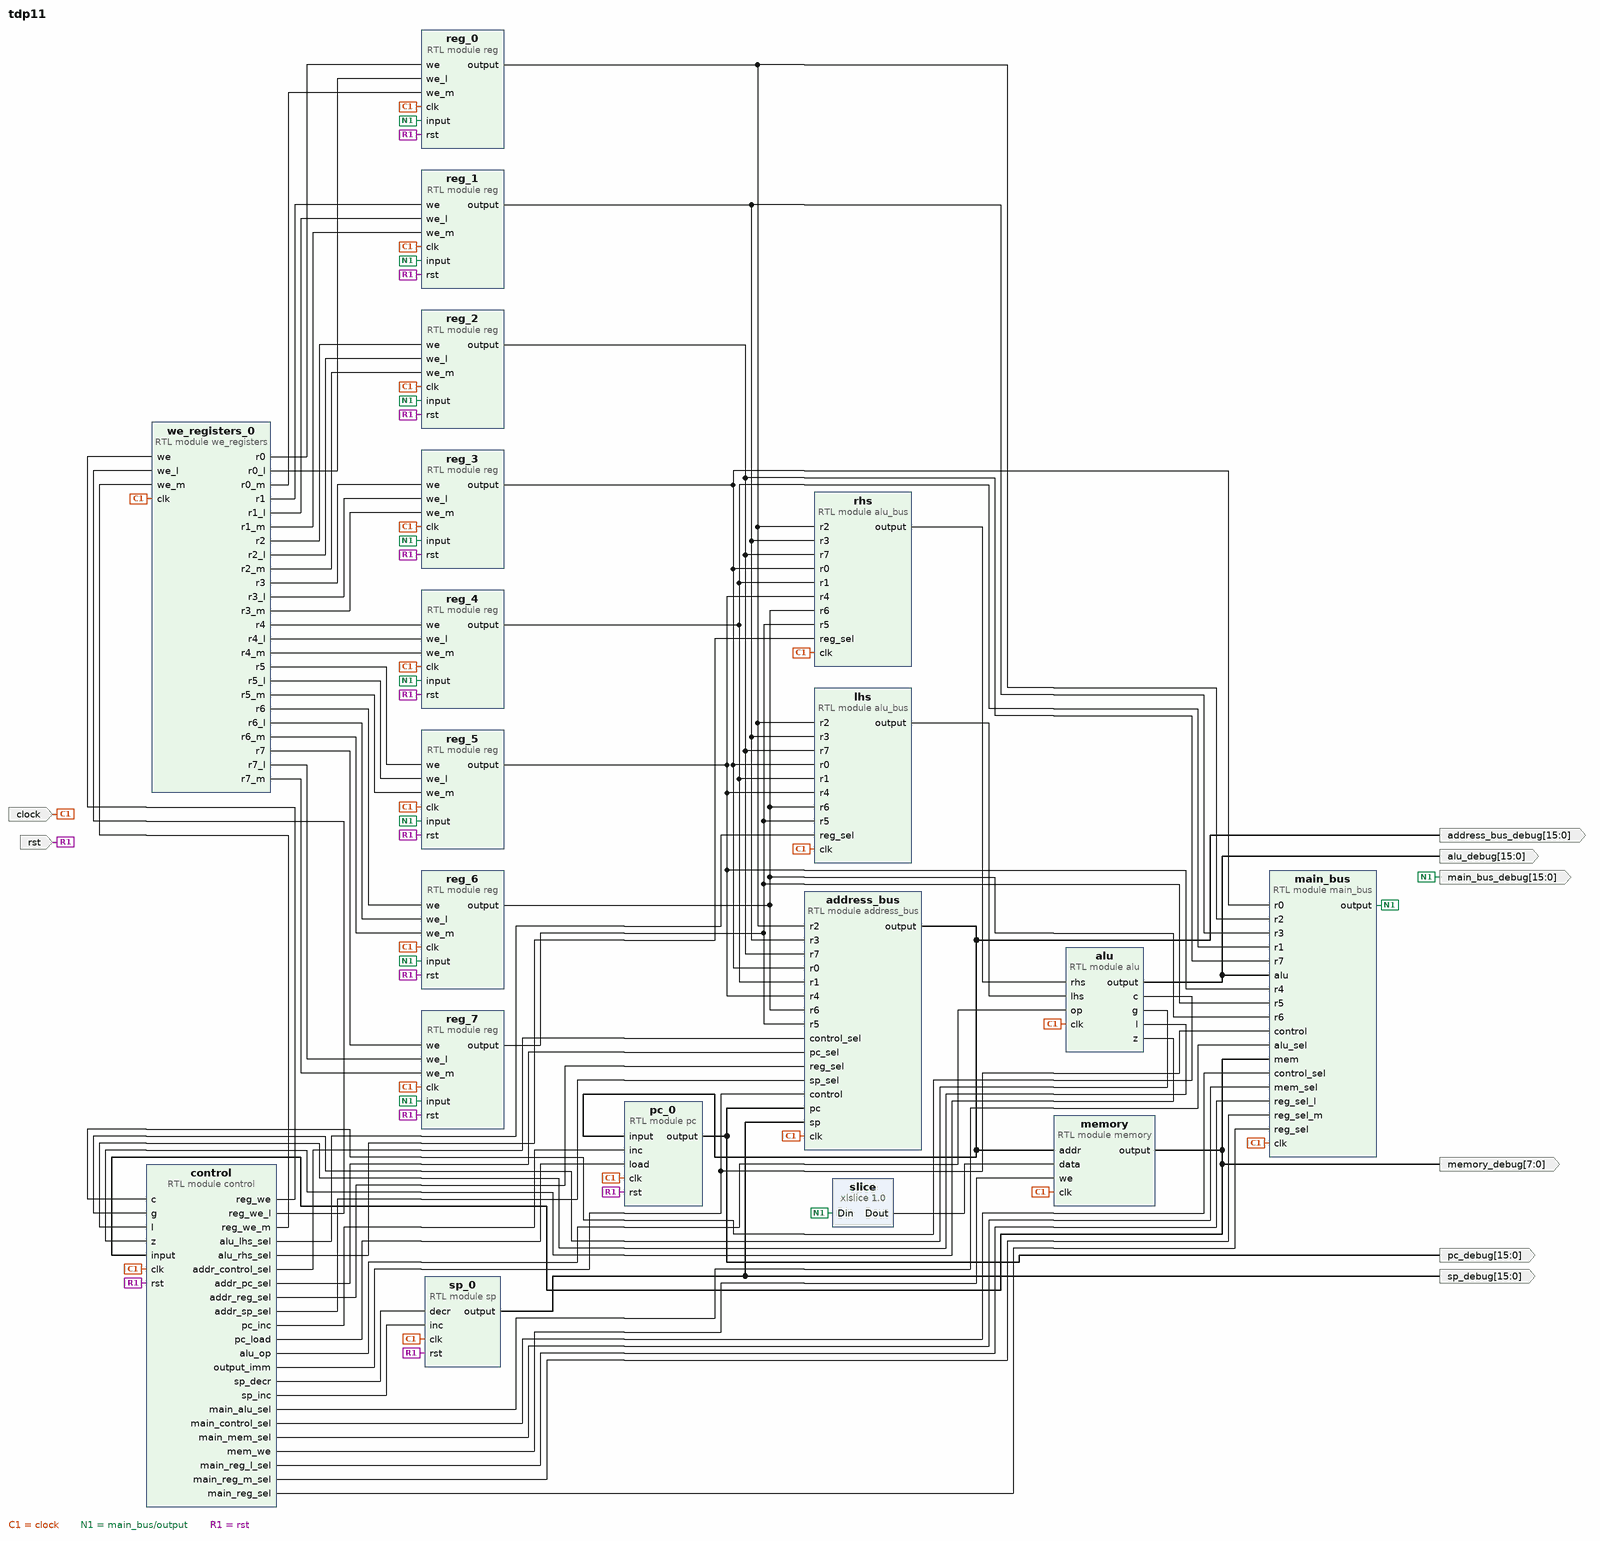
[diagram p0: block diagram of the top level]
# Vivado block design tdp11, xc7a35tcpg236-1, Vivado 2022.1
create_bd_design tdp11

create_bd_port -dir I rst
create_bd_port -dir O -from 15 -to 0 main_bus_debug
create_bd_port -dir O -from 15 -to 0 address_bus_debug
create_bd_port -dir O -from 15 -to 0 pc_debug
create_bd_port -dir O -from 15 -to 0 sp_debug
create_bd_port -dir O -from 7 -to 0 memory_debug
create_bd_port -dir O -from 15 -to 0 alu_debug
create_bd_port -dir I clock

create_bd_cell -type module -reference alu_bus lhs
create_bd_cell -type module -reference alu_bus rhs
create_bd_cell -type ip -vlnv xilinx.com:ip:xlslice:1.0 slice
set_property -dict {CONFIG.DIN_FROM 7 CONFIG.DIN_WIDTH 16 CONFIG.DOUT_WIDTH 8} [get_bd_cells slice]
create_bd_cell -type module -reference main_bus main_bus
create_bd_cell -type module -reference alu alu
create_bd_cell -type module -reference address_bus address_bus
create_bd_cell -type module -reference we_registers we_registers_0
create_bd_cell -type module -reference pc pc_0
create_bd_cell -type module -reference sp sp_0
create_bd_cell -type module -reference reg reg_3
create_bd_cell -type module -reference reg reg_4
create_bd_cell -type module -reference reg reg_0
create_bd_cell -type module -reference reg reg_1
create_bd_cell -type module -reference reg reg_5
create_bd_cell -type module -reference reg reg_7
create_bd_cell -type module -reference reg reg_6
create_bd_cell -type module -reference reg reg_2
create_bd_cell -type module -reference control control
create_bd_cell -type module -reference memory memory

# ---- connections ----

connect_bd_net -net address_bus_0_output [get_bd_pins address_bus/output] \
  [get_bd_ports address_bus_debug] [get_bd_pins pc_0/input] [get_bd_pins memory/addr]
connect_bd_net -net alu_0_output [get_bd_pins alu/output] [get_bd_pins main_bus/alu] [get_bd_ports alu_debug]
connect_bd_net [get_bd_pins alu/c] [get_bd_pins control/c]
connect_bd_net [get_bd_pins alu/g] [get_bd_pins control/g]
connect_bd_net [get_bd_pins alu/l] [get_bd_pins control/l]
connect_bd_net [get_bd_pins alu/z] [get_bd_pins control/z]
connect_bd_net -net clk_clk_out1 [get_bd_ports clock] \
  [get_bd_pins lhs/clk] [get_bd_pins rhs/clk] [get_bd_pins main_bus/clk] [get_bd_pins alu/clk] [get_bd_pins address_bus/clk] \
  [get_bd_pins we_registers_0/clk] [get_bd_pins pc_0/clk] [get_bd_pins sp_0/clk] [get_bd_pins reg_3/clk] \
  [get_bd_pins reg_4/clk] [get_bd_pins reg_0/clk] [get_bd_pins reg_1/clk] [get_bd_pins reg_5/clk] [get_bd_pins reg_7/clk] \
  [get_bd_pins reg_6/clk] [get_bd_pins reg_2/clk] [get_bd_pins control/clk] [get_bd_pins memory/clk]
connect_bd_net [get_bd_pins control/addr_control_sel] [get_bd_pins address_bus/control_sel]
connect_bd_net [get_bd_pins control/addr_pc_sel] [get_bd_pins address_bus/pc_sel]
connect_bd_net [get_bd_pins control/addr_reg_sel] [get_bd_pins address_bus/reg_sel]
connect_bd_net [get_bd_pins control/addr_sp_sel] [get_bd_pins address_bus/sp_sel]
connect_bd_net [get_bd_pins control/alu_lhs_sel] [get_bd_pins lhs/reg_sel]
connect_bd_net [get_bd_pins control/alu_op] [get_bd_pins alu/op]
connect_bd_net [get_bd_pins control/alu_rhs_sel] [get_bd_pins rhs/reg_sel]
connect_bd_net [get_bd_pins control/main_alu_sel] [get_bd_pins main_bus/alu_sel]
connect_bd_net [get_bd_pins control/main_control_sel] [get_bd_pins main_bus/control_sel]
connect_bd_net [get_bd_pins control/main_mem_sel] [get_bd_pins main_bus/mem_sel]
connect_bd_net [get_bd_pins control/main_reg_l_sel] [get_bd_pins main_bus/reg_sel_l]
connect_bd_net [get_bd_pins control/main_reg_m_sel] [get_bd_pins main_bus/reg_sel_m]
connect_bd_net [get_bd_pins control/main_reg_sel] [get_bd_pins main_bus/reg_sel]
connect_bd_net [get_bd_pins control/mem_we] [get_bd_pins memory/we]
connect_bd_net [get_bd_pins control/output_imm] [get_bd_pins main_bus/control] [get_bd_pins address_bus/control]
connect_bd_net [get_bd_pins control/pc_inc] [get_bd_pins pc_0/inc]
connect_bd_net [get_bd_pins control/pc_load] [get_bd_pins pc_0/load]
connect_bd_net [get_bd_pins control/reg_we] [get_bd_pins we_registers_0/we]
connect_bd_net [get_bd_pins control/reg_we_l] [get_bd_pins we_registers_0/we_l]
connect_bd_net [get_bd_pins control/reg_we_m] [get_bd_pins we_registers_0/we_m]
connect_bd_net [get_bd_pins control/sp_decr] [get_bd_pins sp_0/decr]
connect_bd_net [get_bd_pins control/sp_inc] [get_bd_pins sp_0/inc]
connect_bd_net [get_bd_pins lhs/output] [get_bd_pins alu/lhs]
connect_bd_net -net main_bus_0_output [get_bd_pins main_bus/output] \
  [get_bd_pins slice/Din] [get_bd_ports main_bus_debug] [get_bd_pins reg_3/input] [get_bd_pins reg_4/input] \
  [get_bd_pins reg_0/input] [get_bd_pins reg_1/input] [get_bd_pins reg_5/input] [get_bd_pins reg_7/input] \
  [get_bd_pins reg_6/input] [get_bd_pins reg_2/input]
connect_bd_net -net memory_0_output [get_bd_pins memory/output] [get_bd_pins main_bus/mem] [get_bd_ports memory_debug] [get_bd_pins control/input]
connect_bd_net [get_bd_pins pc_0/output] [get_bd_pins address_bus/pc] [get_bd_ports pc_debug]
connect_bd_net -net reg_0_output [get_bd_pins reg_3/output] \
  [get_bd_pins rhs/r0] [get_bd_pins lhs/r0] [get_bd_pins main_bus/r0] [get_bd_pins address_bus/r0]
connect_bd_net -net reg_1_output [get_bd_pins reg_4/output] \
  [get_bd_pins rhs/r1] [get_bd_pins lhs/r1] [get_bd_pins main_bus/r1] [get_bd_pins address_bus/r1]
connect_bd_net -net reg_2_output [get_bd_pins reg_0/output] \
  [get_bd_pins rhs/r2] [get_bd_pins lhs/r2] [get_bd_pins main_bus/r2] [get_bd_pins address_bus/r2]
connect_bd_net -net reg_3_output [get_bd_pins reg_1/output] \
  [get_bd_pins rhs/r3] [get_bd_pins lhs/r3] [get_bd_pins main_bus/r3] [get_bd_pins address_bus/r3]
connect_bd_net -net reg_4_output [get_bd_pins reg_5/output] \
  [get_bd_pins rhs/r4] [get_bd_pins lhs/r4] [get_bd_pins main_bus/r4] [get_bd_pins address_bus/r4]
connect_bd_net -net reg_5_output [get_bd_pins reg_7/output] \
  [get_bd_pins rhs/r5] [get_bd_pins lhs/r5] [get_bd_pins main_bus/r5] [get_bd_pins address_bus/r5]
connect_bd_net [get_bd_pins reg_6/output] [get_bd_pins rhs/r6] [get_bd_pins lhs/r6] [get_bd_pins main_bus/r6] [get_bd_pins address_bus/r6]
connect_bd_net -net reg_7_output [get_bd_pins reg_2/output] \
  [get_bd_pins rhs/r7] [get_bd_pins lhs/r7] [get_bd_pins main_bus/r7] [get_bd_pins address_bus/r7]
connect_bd_net [get_bd_pins rhs/output] [get_bd_pins alu/rhs]
connect_bd_net [get_bd_ports rst] \
  [get_bd_pins pc_0/rst] [get_bd_pins sp_0/rst] [get_bd_pins reg_3/rst] [get_bd_pins reg_4/rst] [get_bd_pins reg_0/rst] \
  [get_bd_pins reg_1/rst] [get_bd_pins reg_5/rst] [get_bd_pins reg_7/rst] [get_bd_pins reg_6/rst] [get_bd_pins reg_2/rst] \
  [get_bd_pins control/rst]
connect_bd_net [get_bd_pins sp_0/output] [get_bd_pins address_bus/sp] [get_bd_ports sp_debug]
connect_bd_net [get_bd_pins we_registers_0/r0] [get_bd_pins reg_0/we]
connect_bd_net [get_bd_pins we_registers_0/r0_l] [get_bd_pins reg_0/we_l]
connect_bd_net [get_bd_pins we_registers_0/r0_m] [get_bd_pins reg_0/we_m]
connect_bd_net [get_bd_pins we_registers_0/r1] [get_bd_pins reg_1/we]
connect_bd_net [get_bd_pins we_registers_0/r1_l] [get_bd_pins reg_1/we_l]
connect_bd_net [get_bd_pins we_registers_0/r1_m] [get_bd_pins reg_1/we_m]
connect_bd_net [get_bd_pins we_registers_0/r2] [get_bd_pins reg_2/we]
connect_bd_net [get_bd_pins we_registers_0/r2_l] [get_bd_pins reg_2/we_l]
connect_bd_net [get_bd_pins we_registers_0/r2_m] [get_bd_pins reg_2/we_m]
connect_bd_net [get_bd_pins we_registers_0/r3] [get_bd_pins reg_3/we]
connect_bd_net [get_bd_pins we_registers_0/r3_l] [get_bd_pins reg_3/we_l]
connect_bd_net [get_bd_pins we_registers_0/r3_m] [get_bd_pins reg_3/we_m]
connect_bd_net [get_bd_pins we_registers_0/r4] [get_bd_pins reg_4/we]
connect_bd_net [get_bd_pins we_registers_0/r4_l] [get_bd_pins reg_4/we_l]
connect_bd_net [get_bd_pins we_registers_0/r4_m] [get_bd_pins reg_4/we_m]
connect_bd_net [get_bd_pins we_registers_0/r5] [get_bd_pins reg_5/we]
connect_bd_net [get_bd_pins we_registers_0/r5_l] [get_bd_pins reg_5/we_l]
connect_bd_net [get_bd_pins we_registers_0/r5_m] [get_bd_pins reg_5/we_m]
connect_bd_net [get_bd_pins we_registers_0/r6] [get_bd_pins reg_6/we]
connect_bd_net [get_bd_pins we_registers_0/r6_l] [get_bd_pins reg_6/we_l]
connect_bd_net [get_bd_pins we_registers_0/r6_m] [get_bd_pins reg_6/we_m]
connect_bd_net [get_bd_pins we_registers_0/r7] [get_bd_pins reg_7/we]
connect_bd_net [get_bd_pins we_registers_0/r7_l] [get_bd_pins reg_7/we_l]
connect_bd_net [get_bd_pins we_registers_0/r7_m] [get_bd_pins reg_7/we_m]
connect_bd_net -net xlslice_0_Dout [get_bd_pins slice/Dout] [get_bd_pins memory/data]

set_property USER_COMMENTS.comment_0 {Debug Ports} [current_bd_design]
set_property USER_COMMENTS.comment_1 {General Purpose 
Registers} [current_bd_design]
set_property USER_COMMENTS.comment_4 {Control Logic} [current_bd_design]
set_property USER_COMMENTS.comment_5 ALU [current_bd_design]
set_property USER_COMMENTS.comment_2 {Program Counter} [current_bd_design]
set_property USER_COMMENTS.comment_3 {ALU LHS Bus} [current_bd_design]
set_property USER_COMMENTS.comment_6 {Program Counter} [current_bd_design]
set_property USER_COMMENTS.comment_7 {Stack Pointer} [current_bd_design]
set_property USER_COMMENTS.comment_8 {Main Bus
} [current_bd_design]
set_property USER_COMMENTS.comment_9 {ALU RHS Bus} [current_bd_design]
set_property USER_COMMENTS.comment_10 {ALU LHS Bus} [current_bd_design]
set_property USER_COMMENTS.comment_11 {Memory (RAM)} [current_bd_design]

validate_bd_design
save_bd_design
